# EAGLE design canDisp (EAGLE 5.11)
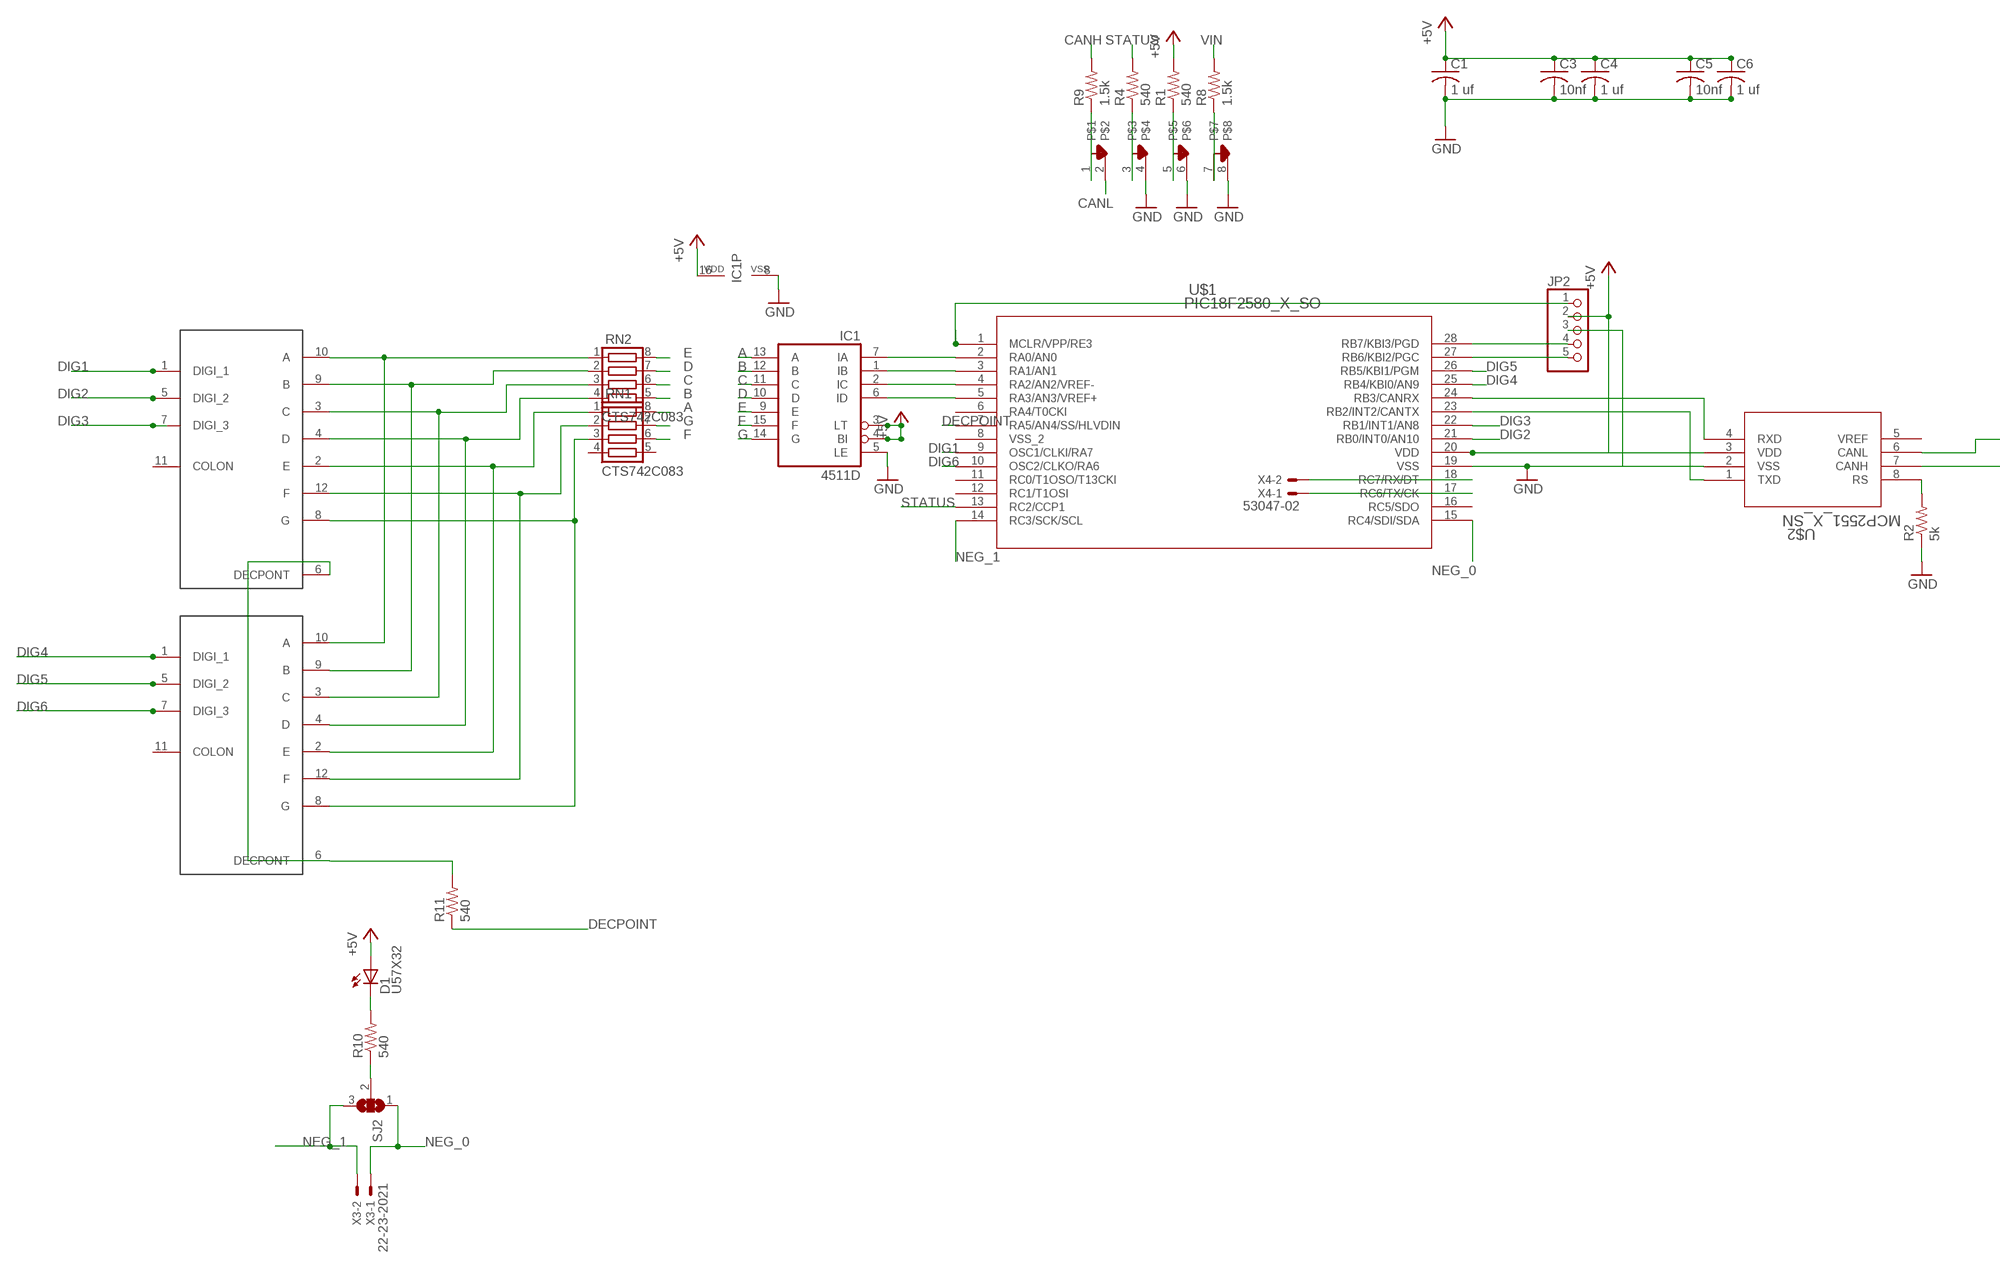
[diagram p0: schematic, sheet 1, part 1 of 2]
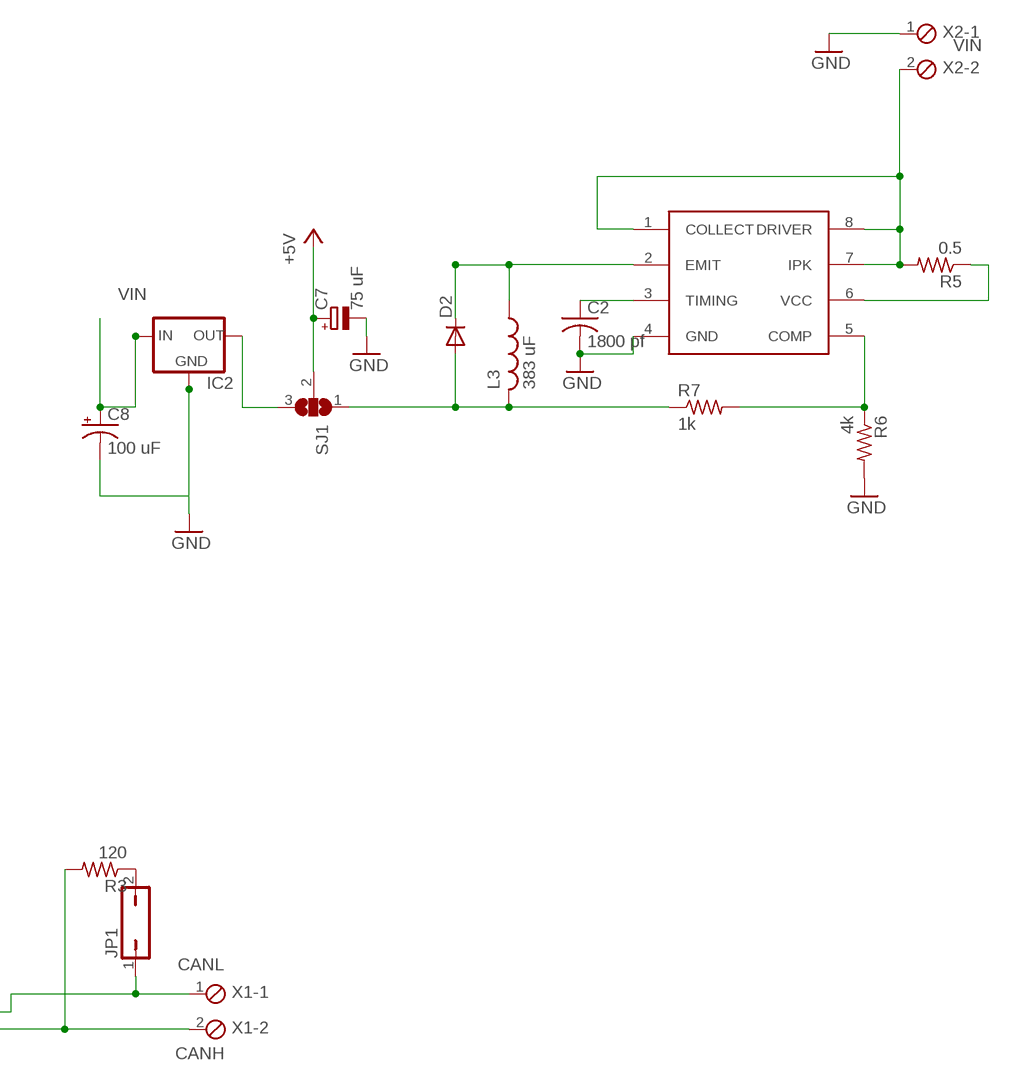
[diagram p1: schematic, sheet 1, part 2 of 2]

## Parts
C1  1 uf  C-USC0805  [C0805]
C2  1800 pf  C-USC0805  [C0805]
C3  10nf  C-USC0805  [C0805]
C4  1 uf  C-USC0805  [C0805]
C5  10nf  C-USC0805  [C0805]
C6  1 uf  C-USC0805  [C0805]
C7  75 uF  CPOL-EUE3.5-10  [E3,5-10]
C8  100 uF  CPOL-USE3.5-8  [E3,5-8]
D1  U57X32  [U57X32]
D2  DIODE-SOD323-W  [SOD323-W]
IC1  4511D  [SO16]
IC2  78MXXS  [78MXXS]
JP1  JP1Q  [JP1]
JP2  PINHD-1X5  [1X05]
L3  383 uF  L-USLAL02  [LAL02]
R1  540  R-US_R0805  [R0805]
R2  5k  R-US_R0805  [R0805]
R3  120  R-US_R0805  [R0805]
R4  540  R-US_R0805  [R0805]
R5  0.5  R-US_R0805  [R0805]
R6  4k  R-US_R0805  [R0805]
R7  1k  R-US_R0805  [R0805]
R8  1.5k  R-US_R0805  [R0805]
R9  1.5k  R-US_R0805  [R0805]
R10  540  R-US_R0805  [R0805]
R11  540  R-US_R0805  [R0805]
RN1  CTS742C083  [CTS742C083]
RN2  CTS742C083  [CTS742C083]
SJ1  SJ2W  [SJ_2]
SJ2  SJ2W  [SJ_2]
U$1  PIC18F2580_X_SO  [SOIC28_W_MC]
U$2  MCP2551_X_SN  [SOIC8_N_MC]
U$3  7_SEG  [7_SEG]
U$4  7_SEG  [7_SEG]
U$5  LED_BAR  [LED_ROW]
U$7  34063  [SO08]
X1  MPT2  [2POL254]
X2  MPT2  [2POL254]
X3  22-23-2021  [22-23-2021]
X4  53047-02  [53047-02]

## Nets
+5V: C1.1 C3.1 C4.1 C5.1 C6.1 C7.+ D1.A IC1.3(LT) IC1.4(BI) IC1.16(VDD) JP2.2 R1.2 SJ1.2 U$1.20(VDD) U$2.3(VDD)
A: IC1.13(A) RN1.8
B: IC1.12(B) RN2.5
C: IC1.11(C) RN2.6
CANH: R3.2 R9.2 U$2.7(CANH) X1.2
CANL: JP1.1 U$2.6(CANL) U$5.2 X1.1
D: IC1.10(D) RN2.7
DECPOINT: R11.1 U$1.7(RA5/AN4/SS/HLVDIN)
DIG1: U$1.9(OSC1/CLKI/RA7) U$3.1(DIGI_1)
DIG2: U$1.21(RB0/INT0/AN10) U$3.5(DIGI_2)
DIG3: U$1.22(RB1/INT1/AN8) U$3.7(DIGI_3)
DIG4: U$1.25(RB4/KBI0/AN9) U$4.1(DIGI_1)
DIG5: U$1.26(RB5/KBI1/PGM) U$4.5(DIGI_2)
DIG6: U$1.10(OSC2/CLKO/RA6) U$4.7(DIGI_3)
E: IC1.9(E) RN2.8
F: IC1.15(F) RN1.6
G: IC1.14(G) RN1.7
GND: C1.2 C2.2 C3.2 C4.2 C5.2 C6.2 C7.- C8.- IC1.5(LE) IC1.8(VSS) IC2.GND JP2.3 R2.1 R6.2 U$1.19(VSS) U$2.2(VSS) U$5.4 U$5.6 U$5.8 U$7.4(GND) X2.1
N$1: JP2.4 U$1.28(RB7/KBI3/PGD)
N$2: JP2.5 U$1.27(RB6/KBI2/PGC)
N$4: JP2.1 U$1.1(MCLR/VPP/RE3)
N$5: R2.2 U$2.8(RS)
N$6: IC1.7(IA) U$1.2(RA0/AN0)
N$7: IC1.1(IB) U$1.3(RA1/AN1)
N$8: IC1.2(IC) U$1.4(RA2/AN2/VREF-)
N$9: IC1.6(ID) U$1.5(RA3/AN3/VREF+)
N$10: U$1.24(RB3/CANRX) U$2.4(RXD)
N$11: R4.1 U$5.3
N$12: RN2.1 U$3.10(A) U$4.10(A)
N$13: RN2.2 U$3.9(B) U$4.9(B)
N$14: RN2.3 U$3.3(C) U$4.3(C)
N$15: RN2.4 U$3.4(D) U$4.4(D)
N$16: RN1.1 U$3.2(E) U$4.2(E)
N$17: RN1.2 U$3.12(F) U$4.12(F)
N$18: RN1.3 U$3.8(G) U$4.8(G)
N$19: R9.1 U$5.1
N$20: R11.2 U$3.6(DECPONT) U$4.6(DECPONT)
N$21: R1.1 U$5.5
N$22: JP1.2 R3.1
N$23: U$1.23(RB2/INT2/CANTX) U$2.1(TXD)
N$24: R8.1 U$5.7
N$25: R5.1 U$7.6(VCC)
N$26: R6.1 R7.2 U$7.5(COMP)
N$27: C2.1 U$7.3(TIMING)
N$29: D2.C L3.1 U$7.2(EMIT)
N$30: D2.A L3.2 R7.1 SJ1.1
N$44: D1.K(C) R10.2
N$45: R10.1 SJ2.2
N$46: IC2.OUT SJ1.3
N$48: U$1.17(RC6/TX/CK) X4.1
N$50: U$1.18(RC7/RX/DT) X4.2
NEG_0: SJ2.1 U$1.15(RC4/SDI/SDA) X3.1
NEG_1: SJ2.3 U$1.14(RC3/SCK/SCL) X3.2
STATUS: R4.2 U$1.13(RC2/CCP1)
VIN: C8.+ IC2.IN R5.2 R8.2 U$7.1(COLLECT) U$7.7(IPK) U$7.8(DRIVER) X2.2
Unconnected: RN1.4 RN1.5 U$1.6(RA4/T0CKI) U$1.8(VSS_2) U$1.11(RC0/T1OSO/T13CKI) U$1.12(RC1/T1OSI) U$1.16(RC5/SDO) U$2.5(VREF) U$3.11(COLON) U$4.11(COLON)

## Library data of the parts
C1-C6 = rcl:C-US: CAPACITOR, American symbol
C7 = rcl:CPOL-EU: POLARIZED CAPACITOR, European symbol
C8 = rcl:CPOL-US: POLARIZED CAPACITOR, American symbol
D1 = led:U57X32: LED rectangle, 5.7 x 3.2 mm
D2 = diode:DIODE-: DIODE
IC1 = 45xx:4511: BCD to 7-segment LATCH/DECODER/DRIVER
IC2 = v-reg:78MXXS: VOLTAGE REGULATOR
JP1 = jumper:JP1Q: JUMPER
JP2 = pinhead:PINHD-1X5: PIN HEADER
L3 = rcl:L-US: INDUCTOR, American symbol
R1-R11 = rcl:R-US_: RESISTOR, American symbol
RN1 RN2 = resistor-net:CTS742C083: Chip Resistor Array 4 Single Resistor Source: http://www.ctscorp.com/components/Datasheets/CTSChipArrayDs.pdf; OC_FARNELL: unknown; OC_NEWARK: unknown
SJ1 SJ2 = jumper:SJ2W: SMD solder JUMPER
U$1 = pic18f2580_s:PIC18F2580_X_SO
U$2 = mcp2551:MCP2551_X_SN
U$3 U$4 = seven_seg_3:7_SEG
U$5 = ledBar:LED_BAR
U$7 = 34063:34063
X1 X2 = con-phoenix-254:MPT2: PHOENIX CONNECTOR; OC_FARNELL: unknown; OC_NEWARK: unknown
X3 = con-molex:22-23-2021: .100" (2.54mm) Center Header - 2 Pin; MF: MOLEX; MPN: 22-23-2021; OC_FARNELL: 1462926; OC_NEWARK: 25C3832
X4 = con-molex:53?-02: CONNECTOR wire to board 1.25 mm (.049 inch) pitch header; MF: MOLEX; MPN: 53047-0210; OC_FARNELL: 9733051; OC_NEWARK: 57H4701

## Board
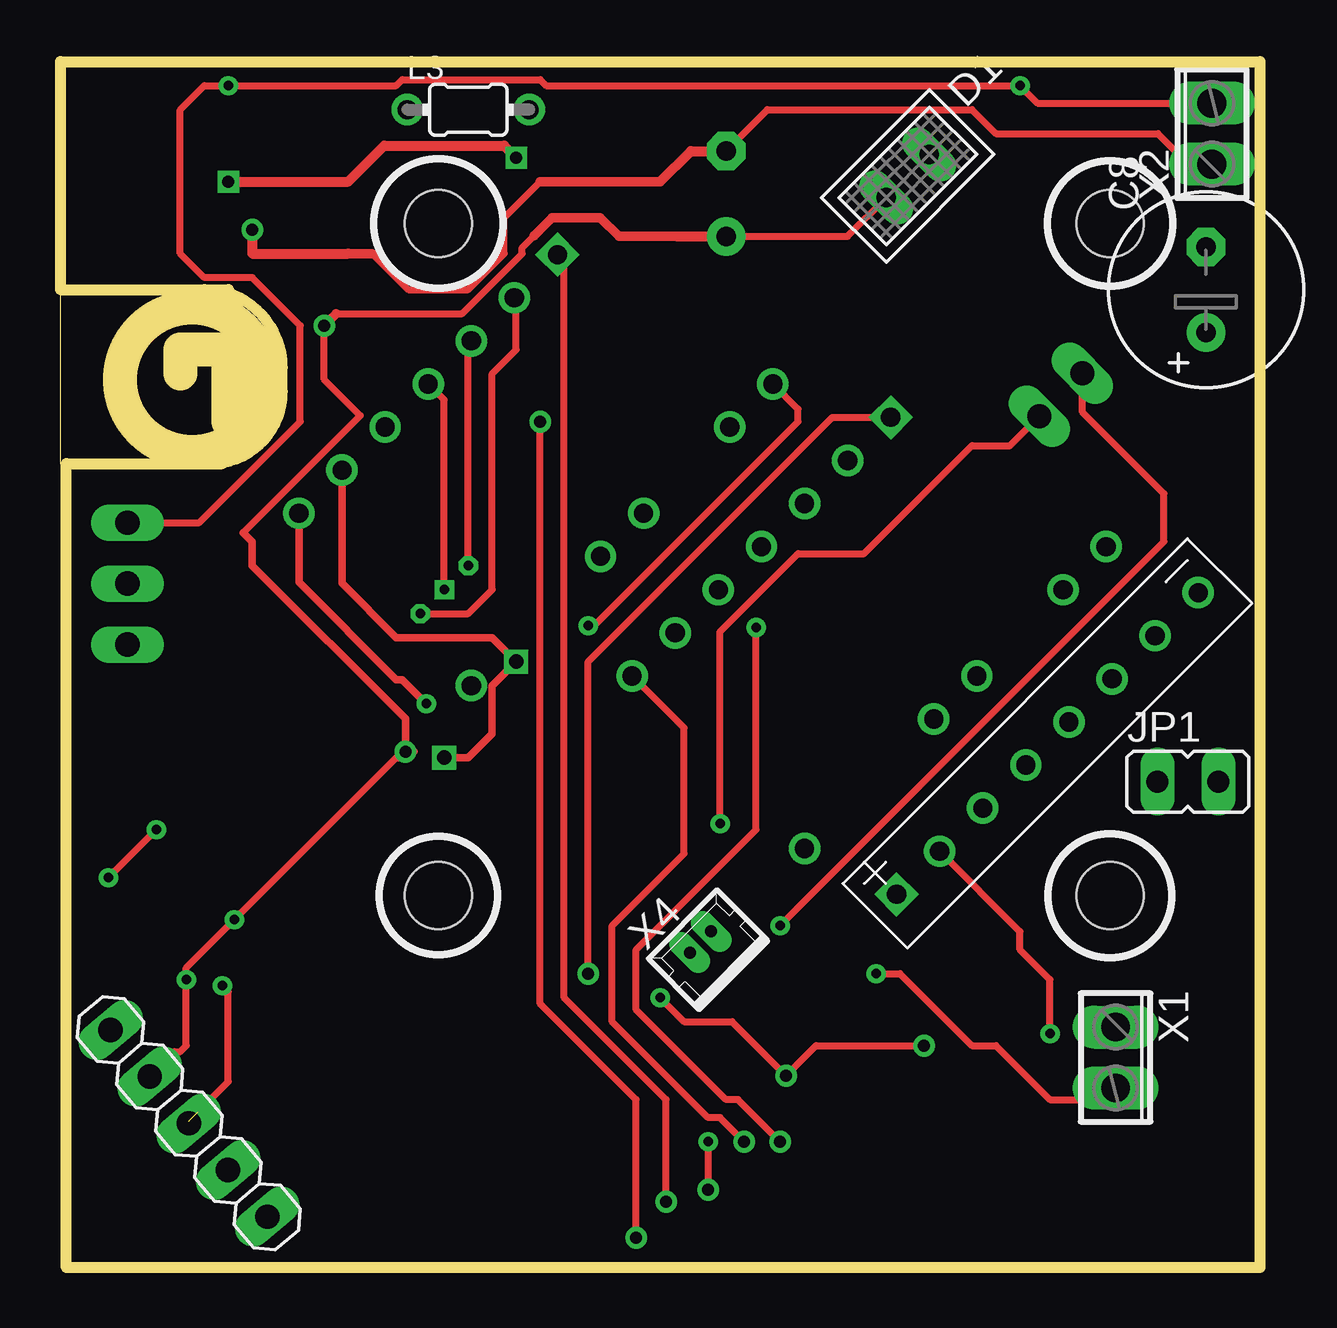
[diagram p2: board, top side]
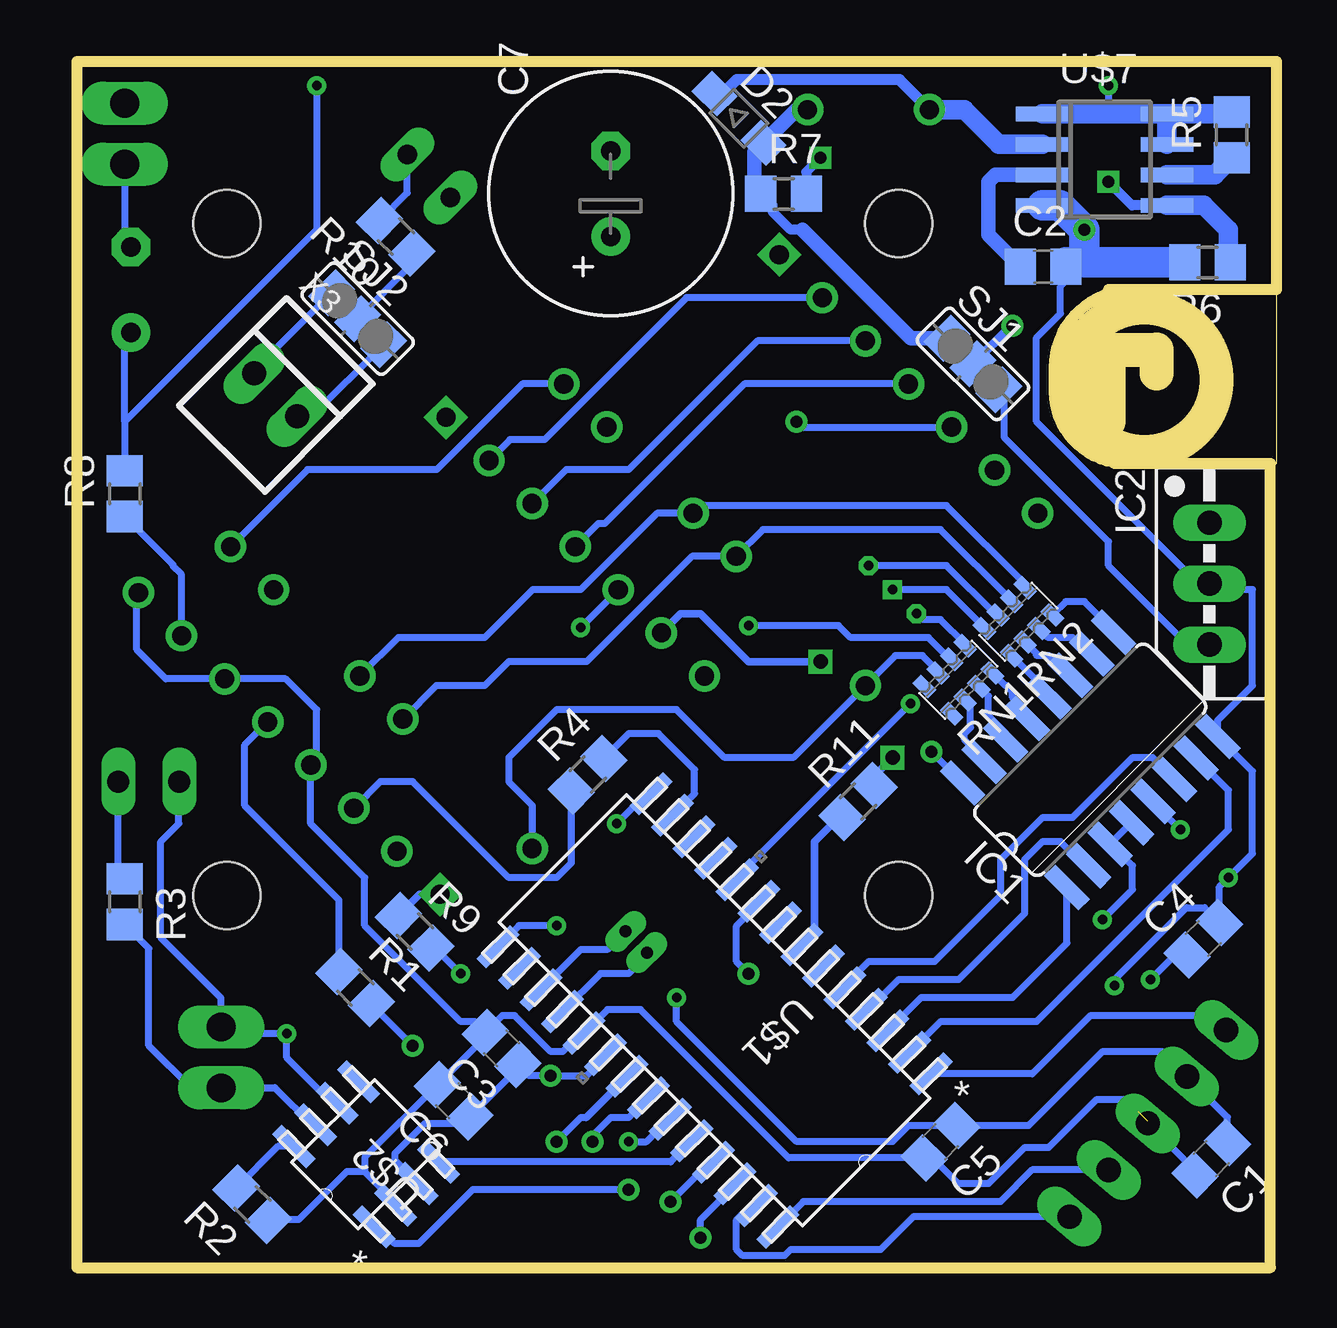
[diagram p3: board, bottom side, seen from below]

Size 50 x 50.25 mm. Coordinates in mm from the lower left corner, seen from the top.
Outline: 6.25,33.5 6.75,33.5
Outline: 6,40.75 0,40.75 0,50.25 50,50.25 50,0 0.25,0 0.25,33.5 6.25,33.5
Outline: 6,40.75 7,40.75
Outline: 6.25,33.5 arc90 9.25,36.5 9.25,37.5 arc90 6,40.75
Outline: 7,38.25 7,35.25 8,35.25 8,38.25 5,38.25 5,37.25
Outline: circle at 5.5,37 radius 3
Copper layers (1*16): Top 0.035mm / dielectric 1.5mm / Bottom 0.035mm
Design rules "default *": minimum track width 10mil, minimum drill 24mil, track to track 5mil, track to pad 5mil, pad to pad 5mil, via to via 5mil, smd to smd 5mil, copper to edge 5mil, drill to drill 5mil, minimum pad ring 10mil, minimum via ring 8mil, stop-mask expansion 4mil, vias tented up to drill 0mil, thermal gap 10mil
Holes 2.8 mm at 15.75,43.5 43.75,43.5 43.75,15.5 15.75,15.5

### Footprints (pad centres in the part's own frame; a part is rotated, then mirrored left to right if it is on the bottom)
C0805 = smd 1.3 x 1.5: 1 -0.95,0; 2 0.95,0
E3,5-10 = drill 0.813 pad 1.6 round: + -1.778,0 | drill 0.813 pad 1.6 octagon: - 1.778,0
E3,5-8 = drill 0.813 pad 1.6 round: + -1.778,0 | drill 0.813 pad 1.6 octagon: - 1.778,0
U57X32 = drill 0.813 long: A -1.27,0; K 1.27,0
SOD323-W = smd 1.5 x 1.2: A 1.45,0; C -1.45,0
SO16 = smd 0.66 x 2.032: 1 -4.445,-3.073; 2 -3.175,-3.073; 3 -1.905,-3.073; 4 -0.635,-3.073; 5 0.635,-3.073; 6 1.905,-3.073; 7 3.175,-3.073; 8 4.445,-3.073; 9 4.445,3.073; 10 3.175,3.073; 11 1.905,3.073; 12 0.635,3.073; 13 -0.635,3.073; 14 -1.905,3.073; 15 -3.175,3.073; 16 -4.445,3.073
78MXXS = drill 1.016 long: GND 0,-2.54; IN -2.54,-2.54; OUT 2.54,-2.54
JP1 = drill 0.914 long: 1 0,-1.27; 2 0,1.27
1X05 = drill 1.016 long: 1 -5.08,0; 2 -2.54,0; 3 0,0; 4 2.54,0; 5 5.08,0
LAL02 = drill 0.8 pad 1.3 round: 1 -2.54,0; 2 2.54,0
R0805 = smd 1.3 x 1.5: 1 -0.95,0; 2 0.95,0
CTS742C083 = smd 0.5 x 0.9: 1 -1.2,-0.8; 2 -0.4,-0.8; 3 0.4,-0.8; 4 1.2,-0.8; 5 1.2,0.8; 6 0.4,0.8; 7 -0.4,0.8; 8 -1.2,0.8
SJ_2 = smd 1.168 x 1.6: 1 -1.524,0; 2 0,0; 3 1.524,0
SOIC28_W_MC = smd 1.981 x 0.559: 1 -4.515,8.255; 2 -4.515,6.985; 3 -4.515,5.715; 4 -4.515,4.445; 5 -4.515,3.175; 6 -4.515,1.905; 7 -4.515,0.635; 8 -4.515,-0.635; 9 -4.515,-1.905; 10 -4.515,-3.175; 11 -4.515,-4.445; 12 -4.515,-5.715; 13 -4.515,-6.985; 14 -4.515,-8.255; 15 4.515,-8.255; 16 4.515,-6.985; 17 4.515,-5.715; 18 4.515,-4.445; 19 4.515,-3.175; 20 4.515,-1.905; 21 4.515,-0.635; 22 4.515,0.635; 23 4.515,1.905; 24 4.515,3.175; 25 4.515,4.445; 26 4.515,5.715; 27 4.515,6.985; 28 4.515,8.255
SOIC8_N_MC = smd 1.981 x 0.559: 1 -2.362,1.905; 2 -2.362,0.635; 3 -2.362,-0.635; 4 -2.362,-1.905; 5 2.362,-1.905; 6 2.362,-0.635; 7 2.362,0.635; 8 2.362,1.905
7_SEG = drill 0.8 square: 1 0,0 | drill 0.8 round: 2 -2.54,0; 3 -5.08,0; 4 -7.62,0; 5 -10.16,0; 6 -12.7,0; 7 -15.24,0; 8 -15.24,-10.16; 9 -7.62,-10.16; 10 -5.08,-10.16; 11 0,-10.16; 12 2.54,-10.16
LED_ROW = drill 0.8 square: 1 0,0 | drill 0.8 round: 2 2.54,0; 3 5.08,0; 4 7.62,0; 5 10.16,0; 6 12.7,0; 7 15.24,0; 8 17.78,0
SO08 = smd 0.6 x 2.2: 1 -1.905,-2.6; 2 -0.635,-2.6; 3 0.635,-2.6; 4 1.905,-2.6; 5 1.905,2.6; 6 0.635,2.6; 7 -0.635,2.6; 8 -1.905,2.6
2POL254 = drill 1.2 long: 1 -1.27,0; 2 1.27,0
22-23-2021 = drill 1 long: 1 -1.27,0; 2 1.27,0
53047-02 = drill 0.5 pad 0.698 long: 1 0.625,0.45; 2 -0.625,0.45

### Placement (x,y rotation side)
C1  2.71,4.54 225 bottom
C2  9.72,41.71 0 bottom
C3  32.29,9.13 135 bottom
C4  3.04,13.71 45 bottom
C5  14,5.25 225 bottom
C6  34.29,6.96 135 bottom
C7  27.75,44.75 90 bottom
C8  47.75,40.75 90 top
D1  35.32,45.49 45 top
D2  22.4,47.9 315 bottom
IC1  7.76,21.16 45 bottom
IC2  0.25,28.5 270 bottom
JP1  47,20.25 270 top
JP2  5.36,6.02 310 top
L3  17,48.25 0 top
R1  38.4,11.67 315 bottom
R2  42.68,2.64 135 bottom
R3  48,15.25 270 bottom
R4  28.71,20.54 45 bottom
R5  1.86,47.2 90 bottom
R6  2.87,41.89 180 bottom
R7  20.54,44.74 0 bottom
R8  48,32.25 90 bottom
R9  35.91,14 315 bottom
R10  36.71,42.96 135 bottom
R11  17.43,19.43 45 bottom
RN1  13.25,24.5 225 bottom
RN2  10.75,26.91 225 bottom
SJ1  12.64,37.65 315 bottom
SJ2  38.29,39.54 315 bottom
U$1  23.42,10.72 225 bottom
U$2  37.93,4.73 135 bottom
U$3  34.61,35.43 45 top
U$4  20.72,42.21 45 top
U$5  34.86,15.56 45 top
U$7  7.16,46.17 270 bottom
X1  43.98,8.76 270 top
X2  48,47.25 90 top
X3  41.71,36.37 315 bottom
X4  27,13.25 45 top

### Tracks (layer width: path | path; a pad name or v marks a point on that pad's centre or on a via)
+5V  (via drill 0.4, 0.4 pad 0.25, 0.4 pad 0.41, 0.5, 0.5 pad 0.25)
  Top 0.3: JP2.2 4.76,9 5,9 5.25,9.25 v5.25,12 5.25,12.5 v7.25,14.5 14,21.25 14.5,21.25 14.75,21.5 v14.38,21.5 | 11.5,39.75 16.75,39.75 19.25,42.25 19.25,42.5 19.75,43 | v25,11.25 26,10.25 28,10.25 v30.25,8 31.5,9.25 v36,9.25 | 7.62,30.62 12.5,35.5 11,37 v11,39.25 | C7.+ 32.81,42.97 D1.A
  Top 0.305: v14.38,21.5 14.38,22.87 8,29.25 8,30.25 7.62,30.62
  Top 0.4: v11,39.25 11.5,39.75 | 25.72,42.97 23.28,42.97 22.5,43.75 20.5,43.75 19.75,43
  Top 0.406: 25.72,42.97 C7.+
  Bottom 0.3: C1.1 2.04,6.27 JP2.2 4.76,9 7.25,9 10.33,5.92 C5.1 15.33,5.92 16,5.25 20,5.25 25,10.25 v25,11.25 | U$2.3 35.81,3.56 36.75,4.5 36.75,4.75 35.5,6 33.91,6 C6.1 31.62,8.29 C3.1 31.16,8 v30.25,8 28.75,8 27.96,8.79 U$1.20 | 3.29,13.04 C4.1 4.21,13.04 v5.25,12 | v14.38,21.5 IC1.16 | R1.2 37.72,10.97 v36,9.25 | IC1.4 | IC1.4 IC1.3 6.89,17.64 6,16.75 6,15.75 v7.25,14.5
  Bottom 0.4: v11,39.25 11.05,39.25 SJ1.2
  Bottom 0.406: SJ1.2 12.64,37.61 | IC1.16 12.94,20.19
A
  Bottom 0.3: IC1.13 10.38,23.13 11,23.75 11,24 11.25,24.25 11.3,24.25 RN1.8
B
  Bottom 0.3: IC1.12 9.48,23.95 RN2.5
C
  Bottom 0.3: IC1.11 8.68,24.68 9.5,25.5 10,25.5 10,25.6 RN2.6
CANH  (via drill 0.4 pad 0.25)
  Top 0.3: v34,12.25 35,12.25 38,9.25 39,9.25 41.25,7 43.5,7 X1.2
  Bottom 0.3: U$2.7 40.2,5.95 41.75,7.5 X1.2 45.24,7.49 47,9.25 47,13.3 R3.2 | R9.2 35.24,13.49 v34,12.25
CANL  (via drill 0.4 pad 0.25)
  Top 0.3: v41.25,9.75 41.25,12 40,13.25 40,14 U$5.2
  Bottom 0.3: U$2.6 39.35,6.85 41.25,8.75 v41.25,9.75 42.5,9.75 | 42.5,9.75 43.71,9.75 | 43.71,9.75 X1.1 43.98,11.23 46.5,13.75 46.5,17.75 45.75,18.5 45.75,20.23 JP1.1 | 43.71,9.75 43.75,9.75 44,10 42.75,10 42.5,9.75
D
  Bottom 0.3: IC1.10 7.83,25.58 8.5,26.25 9.52,26.25 RN2.7
DECPOINT
  Bottom 0.305: R11.1 18.24,18.75 19.25,17.75 19.25,13.99 U$1.7
DIG1  (via drill 0.5 pad 0.25)
  Top 0.3: U$3.1 32.18,35.43 22,25.25 v22,12.25
  Bottom 0.3: U$1.9 21.57,15.18 22.5,14.25 22.5,12.75 v22,12.25
DIG2  (via drill 0.4 pad 0.25, 0.5 pad 0.41)
  Top 0.3: v30,5.25 28.25,7 27.75,7 24,10.75 24,13.25 29,18.25 v29,26.67
  Bottom 0.3: 28.79,6.25 U$1.21 27,8.04 27,8.25 27.5,7.75 27.5,7.5 28.75,6.25 28.79,6.25 | 28.79,6.25 29,6.25 v30,5.25 | v29,26.67 U$3.5
DIG3  (via drill 0.5 pad 0.41)
  Top 0.3: v28.5,5.25 27.5,6.25 27,6.25 23,10.25 23,14.25 26,17.25 26,22.49 U$3.7
  Bottom 0.3: U$1.22 26.99,6.25 27.75,6.25 28.5,5.5 v28.5,5.25
DIG4  (via drill 0.5 pad 0.41)
  Top 0.3: v25.25,2.75 25.25,7 21,11.25 21,41.93 U$4.1
  Bottom 0.3: U$1.25 23.61,4.39 v25.25,2.75
DIG5  (via drill 0.5 pad 0.25, 0.5 pad 0.41)
  Top 0.3: v24,1.25 24,7 20,11 v20,35.25
  Bottom 0.3: U$1.26 22.57,3.43 24,2 v24,1.25 | U$4.5 19.78,35.03 v20,35.25
DIG6  (via drill 0.4 pad 0.25)
  Top 0.305: U$4.7 9.94,28.56 14,24.5 14.25,24.5 v15.25,23.5
  Bottom 0.3: U$1.10 22.47,16.28 v15.25,23.5
E
  Bottom 0.3: IC1.9 6.79,26.54 8,27.75 8.78,27.75 RN2.8
F
  Bottom 0.3: IC1.15 12.18,21.18 13,22 13,22.25 12.75,22.5 12.75,23.43 RN1.6
G
  Bottom 0.3: IC1.14 11.28,22.28 12,23 12,23.82 RN1.7
GND  (via drill 0.4, 0.4 pad 0.25, 0.5)  (1 unrouted)
  Top 0.3: JP2.3 5.36,6.11 7,7.75 7,11.5 v6.75,11.75 | 13,42.25 14.5,40.75 17,40.75 18.5,42.25 18.5,43.75 20,45.25 | C7.- 29.47,48.25 38,48.25 39,47.25 45.75,47.25 47,46 47.98,46 X2.1 | v2,16.25 v4,18.25
  Top 0.4: 12,42.25 13,42.25 | 20,45.25 25,45.25
  Top 0.406: C7.- 26.28,46.53 25,45.25 | 12,42.25 8,42.25 v8,43.25
  Bottom 0.3: C1.2 3.38,4.04 JP2.3 | C3.2 32.27,10.5 31.75,10.5 30.25,9 29.75,9 28.97,9.78 U$1.19 27.88,10.75 26.5,10.75 20.33,4.58 C5.2 14.33,4.58 13.25,3.5 12,3.5 10.5,5 9.5,5 7.5,7 6.25,7 5.75,6.5 | C3.2 32.97,9.63 C6.2 38,4.59 38,4 | U$2.2 36.71,2.71 38,4 | 38,4 38.75,4 40.75,2 41.98,2 R2.1 | v6.75,11.75 6.75,12 3.75,15 2.99,15 C4.2 2.37,15.88 v2,16.25 1,17.25 1,20.69 IC1.8 2.44,22.81 1,24.25 1,28.25 2.54,28.25 IC2.GND 3.25,28.5 10,35.25 10,38.75 9,39.75 9,40.89 8,41.89 | C3.2 33.41,10.25 34,10.25 38,14.25 38,16.25 40.24,18.5 U$5.4 40,21.19 40,23.25 41.28,24.53 U$5.6 46.28,24.53 47.5,25.75 47.5,28.06 U$5.8 | IC1.5 5.14,19.39 v4,18.25 | X2.1 48,42.78 C8.-
  Bottom 1.27: 8,41.89 R6.2 | 8,41.89 8.77,41.89 C2.2 | U$7.4 9.02,44.27 v8,43.25 8,41.89
N$1
  Bottom 0.3: JP2.4 10.18,4.07 11.5,2.75 19.72,2.75 U$1.28
N$2
  Bottom 0.3: JP2.5 15.13,2.12 16.5,0.75 20.25,0.75 20.5,0.5 22.25,0.5 22.5,0.75 22.5,2 22.25,2.25 22.01,2.25 U$1.27
N$4
  Bottom 0.3: U$1.1 10.17,8.08 7.75,10.5 2.68,10.5 JP2.1
N$5
  Bottom 0.3: U$2.8 41.62,5.05 R2.2
N$6
  Bottom 0.3: U$1.2 15.27,8.98 14,10.25 10,10.25 2,18.25 2,19.89 IC1.7
N$7
  Bottom 0.3: IC1.1 8.73,13.52 11,11.25 14.81,11.25 U$1.3
N$8
  Bottom 0.3: U$1.4 16.98,10.77 15.75,12 13.25,12 10.5,14.75 10.5,17 9.75,17.75 9,17.75 8.25,17 8.09,17 IC1.2
N$9
  Bottom 0.3: U$1.5 17.98,11.77 17,12.75 14.25,12.75 11.5,15.5 11.5,17 9.75,18.75 8.5,18.75 6,21.25 5.15,21.25 IC1.6
N$10
  Bottom 0.3: U$2.4 25.25,4.4 U$1.24
N$11
  Bottom 0.3: R4.1 29.38,16.87 30,16.25 32,16.25 36,20.25 37.35,20.25 U$5.3
N$12
  Bottom 0.3: U$3.10 36.61,26.25 33,26.25 31,28.25 29,28.25 25.82,31.43 U$4.10 24,31.75 13.75,31.75 10.47,28.47 RN2.1
N$13
  Bottom 0.3: U$3.9 35.01,24.25 33,24.25 32,25.25 28.75,25.25 24.36,29.64 U$4.9 21.4,30.75 14,30.75 11.03,27.78 RN2.2
N$14  (via drill 0.4 pad 0.41)
  Top 0.3: v17,29.25 17,38.49 U$4.3
  Bottom 0.3: U$4.3 21.63,38.62 27,33.25 29.61,33.25 U$3.3 | RN2.3 11.7,27.2 13.75,29.25 v17,29.25
N$15  (via drill 0.4 pad 0.41)
  Top 0.3: v16,28.25 16,36.15 U$4.4
  Bottom 0.3: U$4.4 22.18,36.82 28,31 28.26,31 U$3.4 | RN2.4 12.16,26.66 13.75,28.25 v16,28.25
N$16  (via drill 0.4 pad 0.41)
  Top 0.3: v15,27.25 17,27.25 18,28.25 18,37.25 19,38.25 19,40.34 U$4.2
  Bottom 0.3: U$4.2 24.59,40.41 30.5,34.5 31.95,34.5 U$3.2 | RN1.1 12.97,25.97 14,27 14.75,27 v15,27.25
N$17  (via drill 0.4 pad 0.25)
  Top 0.3: v22,26.75 22.25,26.75 30.75,35.25 30.75,35.77 U$4.12
  Bottom 0.3: U$4.12 31.43,36.82 35,33.25 40.38,33.25 U$3.12 | RN1.2 13.6,25.35 14.5,26.25 17.75,26.25 18.25,26.75 v22,26.75
N$18
  Bottom 0.3: RN1.3 14.1,24.85 14.75,25.5 15.88,25.5 U$4.8 20.13,21.25 23,21.25 25,23.25 30,23.25 32,21.25 32,20.25 31.02,19.27 U$3.8
N$19
  Bottom 0.305: U$5.1 35.7,15.55 R9.1
N$20  (via drill 0.6)
  Top 0.305: U$4.6 11.74,28.51 14,26.25 18,26.25 v19,25.25 18,24.25 18,22.25 17,21.25 v16,21.25
  Bottom 0.305: v19,25.25 22,25.25 24,27.25 24.83,27.25 U$3.6 | R11.2 16.76,20.5 v16,21.25
N$21
  Bottom 0.3: R1.1 39.07,15.32 43,19.25 43,21.78 U$5.5
N$22
  Bottom 0.3: JP1.2 48.27,16.47 R3.1
N$23  (via drill 0.4, 0.5)
  Top 0.3: v27,5.25 v27,3.25
  Bottom 0.3: U$2.1 37.46,1.71 36.75,1 35.75,1 33.5,3.25 v27,3.25 | U$1.23 25.32,6.18 26.25,5.25 v27,5.25
N$24
  Bottom 0.3: U$5.7 45.63,28.88 46,29.25 46,29.3 R8.1
N$25
  Bottom 0.813: U$7.6 2.57,45.53 R5.1
N$26  (via drill 0.5)
  Top 0.406: v7,45.25 12,45.25 13.5,46.75 18.5,46.75 v19,46.25
  Bottom 0.406: R7.2 19.59,45.66 v19,46.25 | U$7.5 6.02,44.27 v7,45.25
  Bottom 0.813: U$7.5 3.02,44.27 2,43.25 2,41.97 R6.1
N$27
  Bottom 0.61: U$7.3 11.71,45.53 12,45.25 12,43.04 C2.1
N$28  (via drill 0.5 pad 0.41)
  other vias: 24,1.25
N$29
  Bottom 0.45: D2.C 23.08,48.92 22.5,49.5 15.71,49.5 L3.1
  Bottom 0.813: U$7.2 11.55,46.8 13,48.25 L3.1
N$30
  Bottom 0.3: 21.75,46.5 21.74,46.5 D2.A
  Bottom 0.406: 19.75,43.25 20.25,43.25 21,44 21,44.25 R7.1
  Bottom 0.61: L3.2 20,48.25 21.75,46.5 21.75,45 R7.1 | SJ1.1 15.23,38.73 19.75,43.25
N$32  (via drill 0.5)
  other vias: 27,3.25
N$33  (via drill 0.4)
  other vias: 27,5.25
N$35  (via drill 0.4)
  other vias: 5.25,12
N$36  (via drill 0.4)
  other vias: 6.75,11.75
N$37  (via drill 0.4)
  other vias: 17,29.25
N$38  (via drill 0.4)
  other vias: 16,28.25
N$39  (via drill 0.4)
  other vias: 15,27.25
N$40  (via drill 0.4 pad 0.41)
  other vias: 28.5,5.25
N$41  (via drill 0.4 pad 0.41)
  other vias: 30,5.25
N$42  (via drill 0.5 pad 0.25)
  other vias: 36,9.25
N$43  (via drill 0.5 pad 0.41)
  other vias: 25.25,2.75
N$44
  Bottom 0.3: D1.K 36.22,44.79 R10.2
N$45
  Bottom 0.3: R10.1 36.03,41.8 SJ2.2
N$46
  Bottom 0.3: 11.33,36.58 11.33,34.58 7,30.25 7,29.25 3.71,25.96 IC2.OUT
  Bottom 0.406: 11.33,36.58 SJ1.3
N$48
  Bottom 0.3: U$1.17 30.65,11.6 29,13.25 27.88,13.25 X4.1
N$50
  Bottom 0.3: X4.2 26.24,13.01 27,12.25 28.18,12.25 U$1.18
NEG_0  (via drill 0.4 pad 0.25)
  Top 0.3: X3.1 42.6,35.65 46,32.25 46,30.25 v30,14.25
  Bottom 0.3: X3.1 42.6,37.39 SJ2.1 | v30,14.25 31.57,14.25 U$1.15
NEG_1  (via drill 0.4 pad 0.25)
  Top 0.3: v27.5,18.5 27.5,26.5 30.75,29.75 33.5,29.75 38,34.25 39.59,34.25 X3.2
  Bottom 0.3: X3.2 40.21,35.47 SJ2.3 | U$1.14 26.25,19.75 v27.5,18.5
STATUS
  Bottom 0.3: U$1.13 25.14,18.86 24.25,19.75 24.25,20.75 25.75,22.25 27,22.25 R4.2
VIN  (via drill 0.4 pad 0.25)
  Top 0.3: X2.2 40.73,48.52 v40,49.25 20.25,49.25 20,49.5 14.25,49.5 14,49.25 v7,49.25 6,49.25 5,48.25 5,42.25 6,41.25 8,41.25 10,39.25 10,35.25 5.79,31.04 IC2.IN
  Bottom 0.3: v7,49.25 7,48.08 | 48,35.25 R8.2 | 48,35.25 40,43.25 v40,49.25 | 48,35.25 48,38.72 C8.+
  Bottom 0.813: U$7.8 U$7.7 | U$7.8 1.93,48.08 R5.2 | U$7.8 7,48.08 U$7.1

### Text on the board
tOrigins: + | - | SDA | SCL | CAN | http://jbr.io/canDisp-0-1 | Term | Tx | Rx | Vpp | L | L | Vdd | Vcc | H | H | PGD | PGC
bOrigins: + | - | SDA | SCL | Tx | Rx | L | L | H | H